# Altium schematic sheet Tigershark 4DSystems Display Adapter.SchDoc
size A
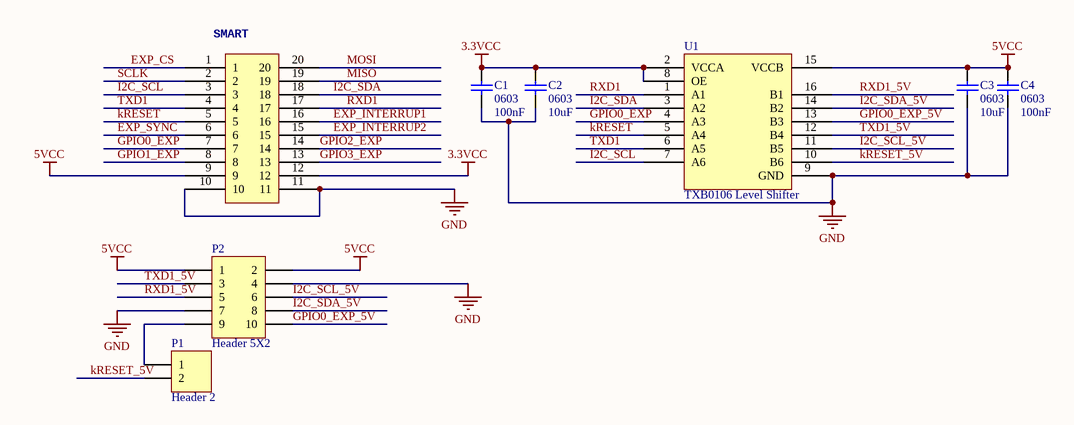
[diagram p0: Tigershark 4DSystems Display Adapter.SchDoc]

## Parts
C1  0603  value 100nF  [1608[0603]]
C2  0603  value 10uF  [1608[0603]]
C3  0603  value 10uF  [1608[0603]]
C4  0603  value 100nF  [1608[0603]]
P1  Header 2  [HDR1X2]
P2  Header 5X2  [HDR2X5]
SMART  10X2-0.1X0.05  [10X2-0.05X0.1 EXP]  (value not drawn)
U1  TXB0106 Level Shifter  [TSOP65P640X120-16N]

## Nets
3.3VCC: C1.2 C2.2 SMART.12 U1.2(VCCA) U1.8(OE)
5VCC: C3.2 C4.2 P2.1 P2.2 SMART.9 U1.15(VCCB)
GND: C1.1 C2.1 C3.1 C4.1 P2.4 P2.7 SMART.10 SMART.11 U1.9(GND)
EXP_CS: SMART.1
EXP_INTERRUP1: SMART.16
EXP_INTERRUP2: SMART.15
EXP_SYNC: SMART.6
GPIO0_EXP: SMART.7 U1.4(A3)
GPIO0_EXP_5V: P2.10 U1.13(B3)
GPIO1_EXP: SMART.8
GPIO2_EXP: SMART.14
GPIO3_EXP: SMART.13
I2C_SCL: SMART.3 U1.7(A6)
I2C_SCL_5V: P2.6 U1.11(B5)
I2C_SDA: SMART.18 U1.3(A2)
I2C_SDA_5V: P2.8 U1.14(B2)
kRESET: SMART.5 U1.5(A4)
kRESET_5V: P1.2 U1.10(B6)
MISO: SMART.19
MOSI: SMART.20
RXD1: SMART.17 U1.1(A1)
RXD1_5V: P2.5 U1.16(B1)
SCLK: SMART.2
TXD1: SMART.4 U1.6(A5)
TXD1_5V: P2.3 U1.12(B4)
NetP1_1: P1.1 P2.9

## Library data of the parts
C1-C4 = Cap Semi: Capacitor (Semiconductor SIM Model); Published: 8-Jun-2000; LatestRevisionDate: 29-May-2009; LatestRevisionNote: IPC-7351 Footprint Added.; PackageReference: C1206; Publisher: Altium Limited; PackageDescription: Chip Capacitor
P1 = Header 2: Header, 2-Pin; LatestRevisionDate: 17-Jul-2002; LatestRevisionNote: Re-released for DXP Platform.; Publisher: Altium Limited
P2 = Header 5X2: Header, 5-Pin, Dual row; LatestRevisionDate: 17-Jul-2002; LatestRevisionNote: Re-released for DXP Platform.; Publisher: Altium Limited
SMART = 10X2-0.1X0.05: LastRevisionNote: ImportComponents; Published: 23-Apr-2014; Publisher: UltiMachine; LastRevisionDate: 23-Apr-2014
U1 = TXB0106: TXB0106 - Bidriectional Opendrain/pushpull level shift